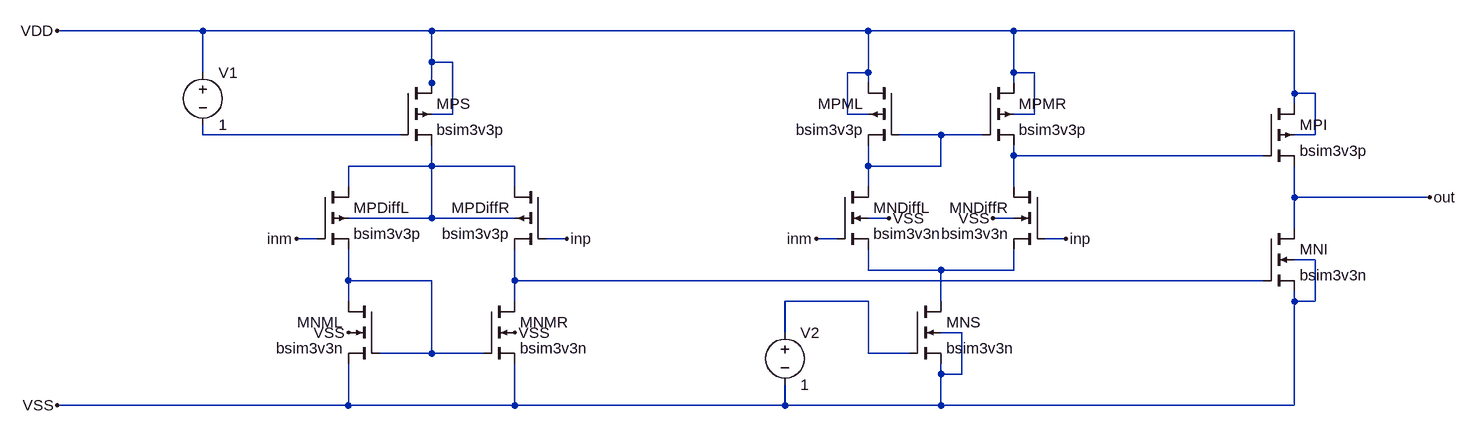
[diagram p0: schematic opa_instance.asc]
opa_instance.asc, the LTspice schematic file:
Version 4
SHEET 1 3160 812
WIRE 1024 -768 800 -768
WIRE 1376 -768 1024 -768
WIRE 2048 -768 1376 -768
WIRE 2272 -768 2048 -768
WIRE 2704 -768 2272 -768
WIRE 1376 -720 1376 -768
WIRE 1408 -720 1376 -720
WIRE 1024 -704 1024 -768
WIRE 2048 -704 2048 -768
WIRE 2048 -704 2016 -704
WIRE 2272 -704 2272 -768
WIRE 2304 -704 2272 -704
WIRE 1376 -688 1376 -720
WIRE 2048 -688 2048 -704
WIRE 2272 -688 2272 -704
WIRE 1376 -672 1376 -688
WIRE 2704 -672 2704 -768
WIRE 2736 -672 2704 -672
WIRE 2704 -656 2704 -672
WIRE 1408 -640 1408 -720
WIRE 1408 -640 1376 -640
WIRE 2016 -640 2016 -704
WIRE 2048 -640 2016 -640
WIRE 2304 -640 2304 -704
WIRE 2304 -640 2272 -640
WIRE 1024 -608 1024 -624
WIRE 1328 -608 1024 -608
WIRE 2160 -608 2096 -608
WIRE 2224 -608 2160 -608
WIRE 2736 -608 2736 -672
WIRE 2736 -608 2704 -608
WIRE 2272 -576 2272 -592
WIRE 2656 -576 2272 -576
WIRE 1376 -560 1376 -592
WIRE 1376 -560 1248 -560
WIRE 1504 -560 1376 -560
WIRE 2048 -560 2048 -592
WIRE 2160 -560 2160 -608
WIRE 2160 -560 2048 -560
WIRE 1248 -528 1248 -560
WIRE 1504 -528 1504 -560
WIRE 2048 -528 2048 -560
WIRE 2272 -528 2272 -576
WIRE 2704 -512 2704 -560
WIRE 2912 -512 2704 -512
WIRE 1376 -480 1376 -560
WIRE 1376 -480 1248 -480
WIRE 1504 -480 1376 -480
WIRE 2080 -480 2048 -480
WIRE 2272 -480 2240 -480
WIRE 2704 -464 2704 -512
WIRE 1200 -448 1168 -448
WIRE 1584 -448 1552 -448
WIRE 2000 -448 1968 -448
WIRE 2352 -448 2320 -448
WIRE 2736 -416 2704 -416
WIRE 2048 -400 2048 -432
WIRE 2160 -400 2048 -400
WIRE 2272 -400 2272 -432
WIRE 2272 -400 2160 -400
WIRE 1248 -384 1248 -432
WIRE 1376 -384 1248 -384
WIRE 1504 -384 1504 -432
WIRE 2656 -384 1504 -384
WIRE 1248 -352 1248 -384
WIRE 1504 -352 1504 -384
WIRE 2048 -352 1920 -352
WIRE 2160 -352 2160 -400
WIRE 2704 -352 2704 -368
WIRE 2736 -352 2736 -416
WIRE 2736 -352 2704 -352
WIRE 1920 -304 1920 -352
WIRE 2192 -304 2160 -304
WIRE 1376 -272 1376 -384
WIRE 1376 -272 1296 -272
WIRE 1456 -272 1376 -272
WIRE 2048 -272 2048 -352
WIRE 2112 -272 2048 -272
WIRE 2160 -240 2160 -256
WIRE 2192 -240 2192 -304
WIRE 2192 -240 2160 -240
WIRE 1248 -192 1248 -256
WIRE 1248 -192 800 -192
WIRE 1504 -192 1504 -256
WIRE 1504 -192 1248 -192
WIRE 1920 -192 1920 -224
WIRE 1920 -192 1504 -192
WIRE 2160 -192 2160 -240
WIRE 2160 -192 1920 -192
WIRE 2704 -192 2704 -352
WIRE 2704 -192 2160 -192
FLAG 1248 -304 VSS
FLAG 1504 -304 VSS
FLAG 800 -192 VSS
FLAG 800 -768 VDD
FLAG 1584 -448 inp
FLAG 1168 -448 inm
FLAG 2912 -512 out
FLAG 2080 -480 VSS
FLAG 2240 -480 VSS
FLAG 1968 -448 inm
FLAG 2352 -448 inp
DATAFLAG 1360 -384 ""
DATAFLAG 1344 -560 ""
DATAFLAG 1648 -384 ""
DATAFLAG 2576 -576 ""
DATAFLAG 2800 -512 ""
DATAFLAG 1696 -192 ""
DATAFLAG 1664 -768 ""
SYMBOL pmos4 2224 -688 R0
SYMATTR InstName MPMR
SYMATTR Value bsim3v3p
SYMATTR Value2 l=1u w=2.4u m=10
SYMBOL pmos4 2096 -688 M0
SYMATTR InstName MPML
SYMATTR Value bsim3v3p
SYMATTR Value2 l=1u w=2.4u m=10
SYMBOL nmos4 2000 -528 R0
SYMATTR InstName MNDiffL
SYMATTR Value bsim3v3n
SYMATTR Value2 l=0.6u w=1.2u m=4
SYMBOL nmos4 2320 -528 M0
SYMATTR InstName MNDiffR
SYMATTR Value bsim3v3n
SYMATTR Value2 l=0.6u w=1.2u m=4
SYMBOL nmos4 2112 -352 R0
SYMATTR InstName MNS
SYMATTR Value bsim3v3n
SYMATTR Value2 l=10u w=1.5u m=2
SYMBOL nmos4 1456 -352 R0
SYMATTR InstName MNMR
SYMATTR Value bsim3v3n
SYMATTR Value2 l=0.6u w=1.5u m=2
SYMBOL nmos4 1296 -352 M0
SYMATTR InstName MNML
SYMATTR Value bsim3v3n
SYMATTR Value2 l=0.6u w=1.5u m=2
SYMBOL pmos4 1200 -528 R0
SYMATTR InstName MPDiffL
SYMATTR Value bsim3v3p
SYMATTR Value2 l=0.6u w=1.2u m=2
SYMBOL pmos4 1552 -528 M0
SYMATTR InstName MPDiffR
SYMATTR Value bsim3v3p
SYMATTR Value2 l=0.6u w=1.2u m=2
SYMBOL pmos4 1328 -688 R0
SYMATTR InstName MPS
SYMATTR Value bsim3v3p
SYMATTR Value2 l=1u w=1.2u m=8
SYMBOL nmos4 2656 -464 R0
SYMATTR InstName MNI
SYMATTR Value bsim3v3n
SYMATTR Value2 l=0.6u w=1.2u m=10
SYMBOL pmos4 2656 -656 R0
SYMATTR InstName MPI
SYMATTR Value bsim3v3p
SYMATTR Value2 l=0.6u w=3.6u m=10
SYMBOL voltage 1024 -720 R0
WINDOW 123 0 0 Left 0
WINDOW 39 0 0 Left 0
SYMATTR InstName V1
SYMATTR Value 1
SYMBOL voltage 1920 -320 R0
WINDOW 123 0 0 Left 0
WINDOW 39 0 0 Left 0
SYMATTR InstName V2
SYMATTR Value 1

The netlist it stands for:
* opa_instance.asc
MPMR VDD N002 N003 VDD bsim3v3p l=1u w=2.4u m=10
MPML VDD N002 N002 VDD bsim3v3p l=1u w=2.4u m=10
MNDiffL N002 inm N005 VSS bsim3v3n l=0.6u w=1.2u m=4
MNDiffR N003 inp N005 VSS bsim3v3n l=0.6u w=1.2u m=4
MNS N005 N008 VSS VSS bsim3v3n l=10u w=1.5u m=2
MNMR N007 N006 VSS VSS bsim3v3n l=0.6u w=1.5u m=2
MNML N006 N006 VSS VSS bsim3v3n l=0.6u w=1.5u m=2
MPDiffL N004 inm N006 N004 bsim3v3p l=0.6u w=1.2u m=2
MPDiffR N004 inp N007 N004 bsim3v3p l=0.6u w=1.2u m=2
MPS VDD N001 N004 VDD bsim3v3p l=1u w=1.2u m=8
MNI out N007 VSS VSS bsim3v3n l=0.6u w=1.2u m=10
MPI VDD N003 out VDD bsim3v3p l=0.6u w=3.6u m=10
V1 VDD N001 1
V2 N008 VSS 1
.model NMOS NMOS
.model PMOS PMOS
.lib standard.mos
.backanno
.end